# Altium schematic sheet Sheet1.SchDoc: Chassis - Projekt Horizon
size A3; SheetNumber: 1; SheetTotal: 1
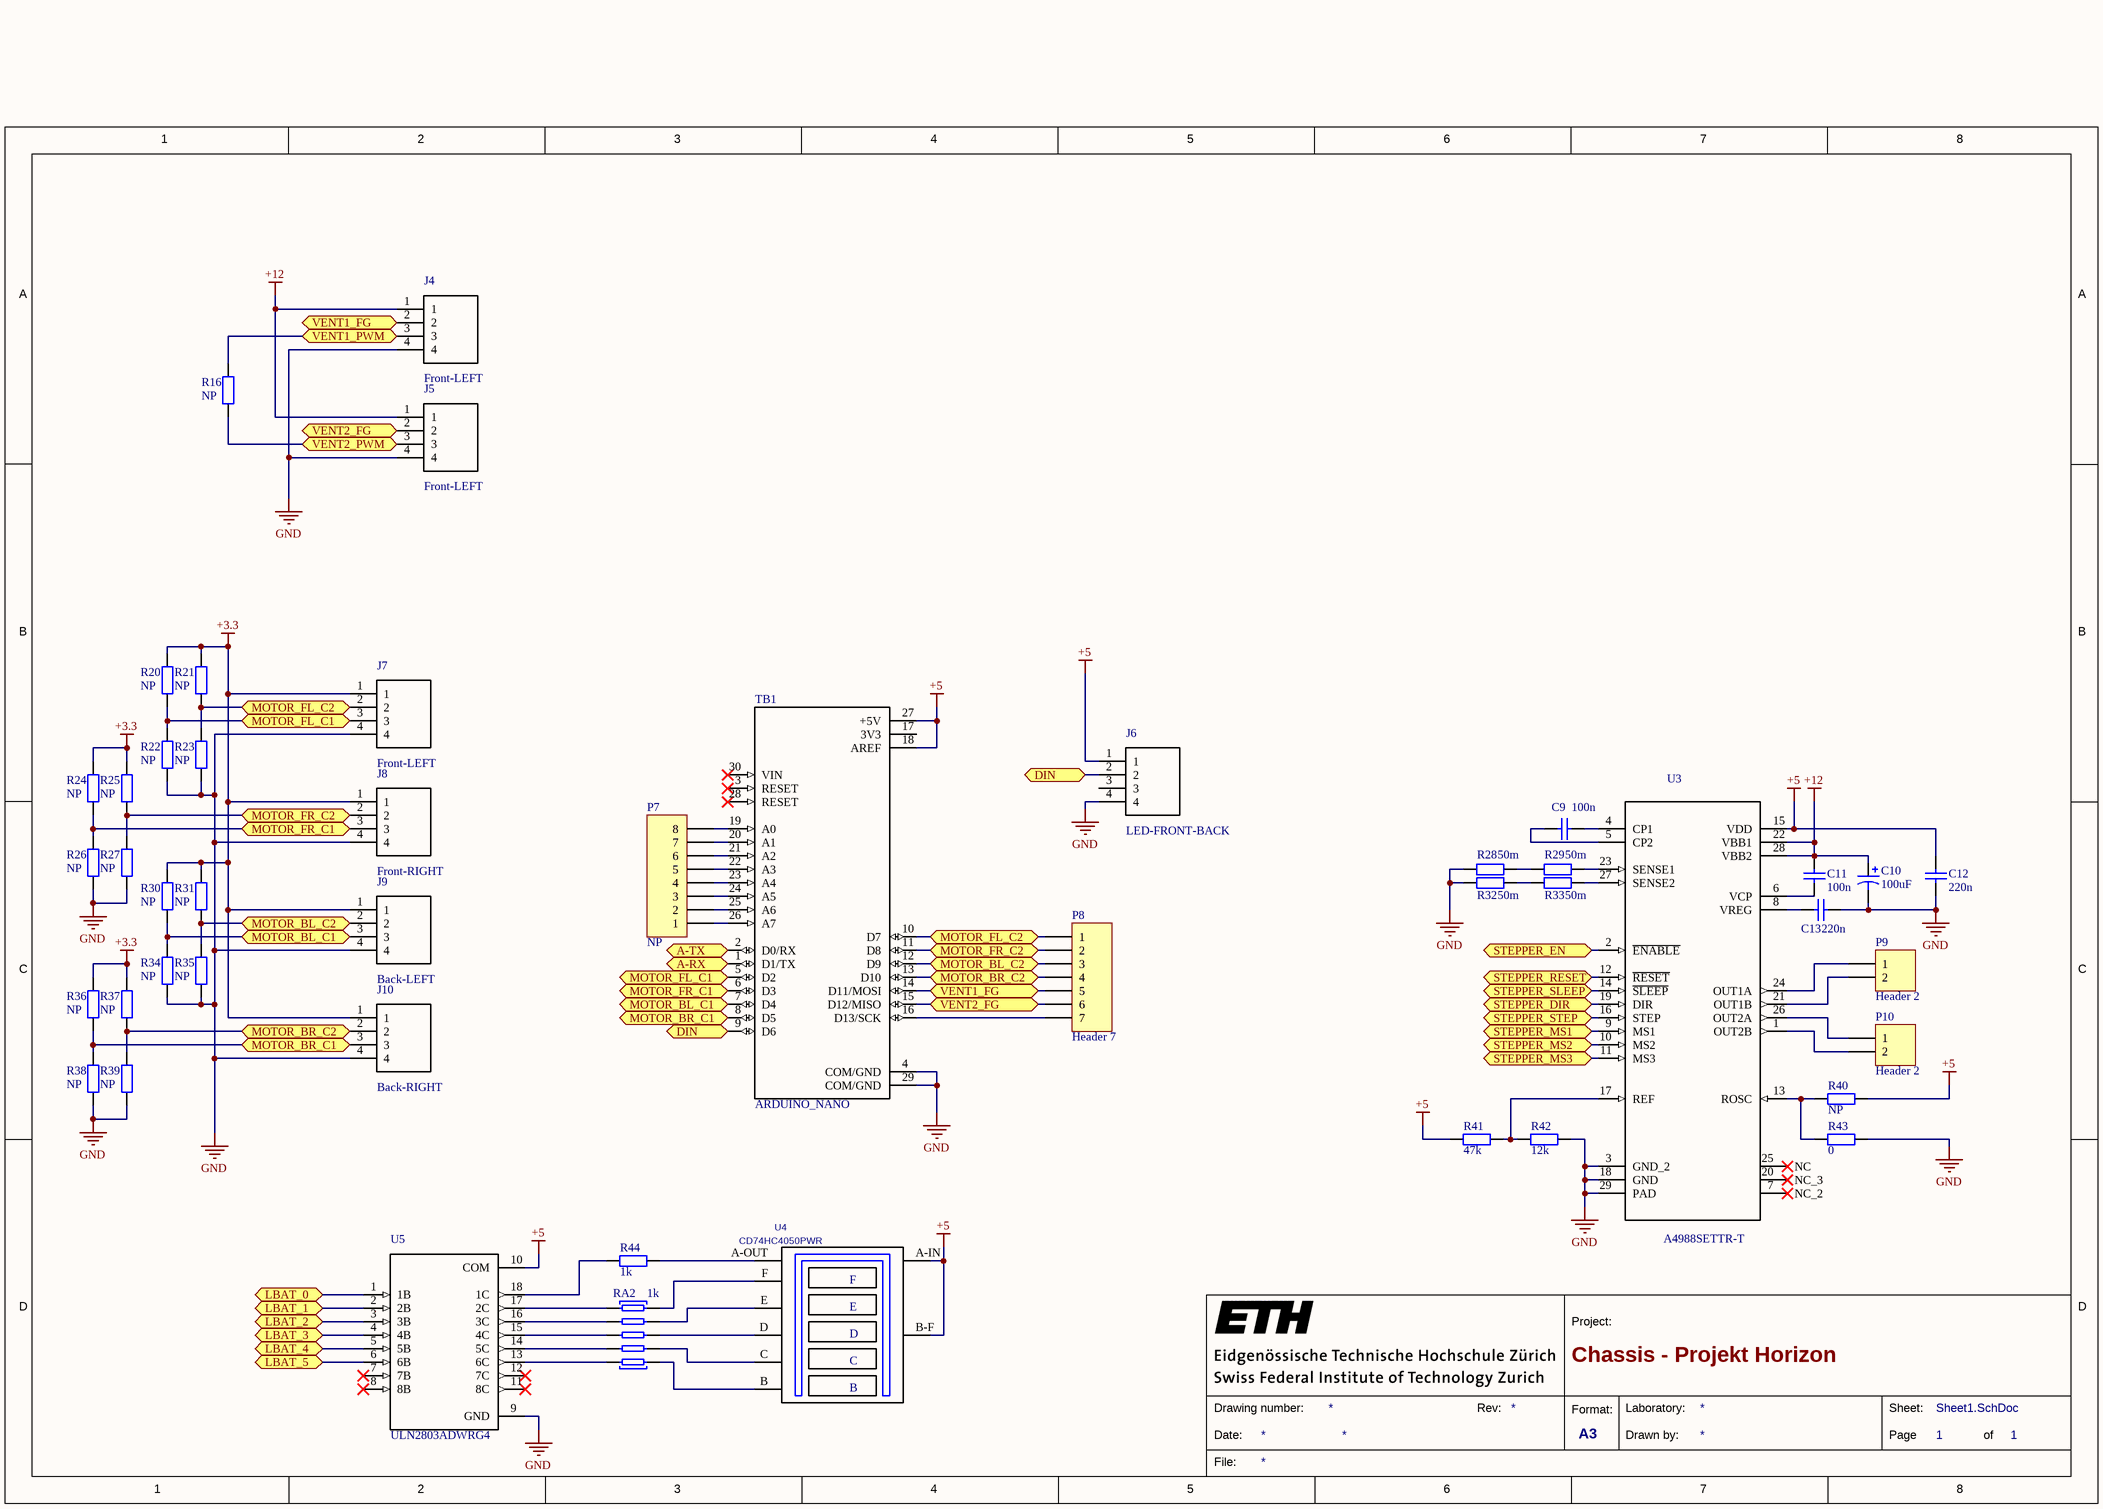
[diagram p0: Sheet1.SchDoc]

## Parts
C9  100n  [CAP_0603i_1608m -N]
C10  100uF  [Cap_F-Type-Package]
C11  100n  [CAP_0603i_1608m -N]
C12  220n  [CAP_0603i_1608m -N]
C13  220n  [CAP_0603i_1608m -N]
J4  Front-LEFT  [*PHOENIX_1751264]
J5  Front-LEFT  [*PHOENIX_1751264]
J6  LED-FRONT-BACK  [*PHOENIX_1751264]
J7  Front-LEFT  [*PHOENIX_1751264]
J8  Front-RIGHT  [*PHOENIX_1751264]
J9  Back-LEFT  [*PHOENIX_1751264]
J10  Back-RIGHT  [*PHOENIX_1751264]
P7  NP  [HDR1X8]
P8  Header 7  [HDR1X7]
P9  Header 2  [3.5MM Phoenix Contact 1984617]
P10  Header 2  [3.5MM Phoenix Contact 1984617]
R16  NP  [RES_0603i_1608m -N]
R20  NP  [RES_0603i_1608m -N]
R21  NP  [RES_0603i_1608m -N]
R22  NP  [RES_0603i_1608m -N]
R23  NP  [RES_0603i_1608m -N]
R24  NP  [RES_0603i_1608m -N]
R25  NP  [RES_0603i_1608m -N]
R26  NP  [RES_0603i_1608m -N]
R27  NP  [RES_0603i_1608m -N]
R28  50m  [RES_1206i_C3216m -N]
R29  50m  [RES_1206i_C3216m -N]
R30  NP  [RES_0603i_1608m -N]
R31  NP  [RES_0603i_1608m -N]
R32  50m  [RES_1206i_C3216m -N]
R33  50m  [RES_1206i_C3216m -N]
R34  NP  [RES_0603i_1608m -N]
R35  NP  [RES_0603i_1608m -N]
R36  NP  [RES_0603i_1608m -N]
R37  NP  [RES_0603i_1608m -N]
R38  NP  [RES_0603i_1608m -N]
R39  NP  [RES_0603i_1608m -N]
R40  NP  [RES_0603i_1608m -N]
R41  47k  [RES_0603i_1608m -N]
R42  12k  [RES_0603i_1608m -N]
R43  0  [RES_0603i_1608m -N]
R44  1k  [RES_0603i_1608m -N]
RA2  1k  [*SIP-10]
TB1  ARDUINO_NANO  [*SHIELD_ARDUINO_NANO]
U3  A4988SETTR-T  [*QFN50P500X500X100-29N]
U4  CD74HC4050PWR  [KYX3118BRG]
U5  ULN2803ADWRG4  [*SOIC127P1030X265-18N]

## Ports
A-RX (bidir), A-TX (bidir), DIN (bidir), LBAT_0 (bidir), LBAT_1 (bidir), LBAT_2 (bidir), LBAT_3 (bidir), LBAT_4 (bidir), LBAT_5 (bidir), MOTOR_BL_C1 (bidir), MOTOR_BL_C2 (bidir), MOTOR_BR_C1 (bidir), MOTOR_BR_C2 (bidir), MOTOR_FL_C1 (bidir), MOTOR_FL_C2 (bidir), MOTOR_FR_C1 (bidir), MOTOR_FR_C2 (bidir), STEPPER_DIR (bidir), STEPPER_EN (bidir), STEPPER_MS1 (bidir), STEPPER_MS2 (bidir), STEPPER_MS3 (bidir), STEPPER_RESET (bidir), STEPPER_SLEEP (bidir), STEPPER_STEP (bidir), VENT1_FG (bidir), VENT1_PWM (bidir), VENT2_FG (bidir), VENT2_PWM (bidir)

## Nets
+3.3: J7.1 J8.1 J9.1 J10.1 R20.2 R21.2 R24.2 R25.2 R30.2 R31.2 R36.2 R37.2
+5: C12.2 J6.1 R40.2 R41.1 TB1.18(AREF) TB1.27(+5V) U3.15(VDD) U4.A-IN U4.B-F U5.10(COM)
+12: C10.1 C11.1 J4.1 J5.1 U3.22(VBB1) U3.28(VBB2)
GND: C10.2 C12.1 C13.2 J4.4 J5.4 J6.4 J7.4 J8.4 J9.4 J10.4 R22.1 R23.1 R26.1 R27.1 R28.1 R32.1 R34.1 R35.1 R38.1 R39.1 R42.2 R43.2 TB1.4(COM/GND) TB1.29(COM/GND) U3.3(GND_2) U3.18(GND) U3.29(PAD) U5.9(GND)
A-RX: TB1.1(D1/TX) ; port A-RX
A-TX: TB1.2(D0/RX) ; port A-TX
DIN: J6.2 TB1.9(D6) ; port DIN
LBAT_0: U5.1(1B) ; port LBAT_0
LBAT_1: U5.2(2B) ; port LBAT_1
LBAT_2: U5.3(3B) ; port LBAT_2
LBAT_3: U5.4(4B) ; port LBAT_3
LBAT_4: U5.5(5B) ; port LBAT_4
LBAT_5: U5.6(6B) ; port LBAT_5
MOTOR_BL_C1: J9.3 R30.1 R34.2 TB1.7(D4) ; port MOTOR_BL_C1
MOTOR_BL_C2: J9.2 P8.3 R31.1 R35.2 TB1.12(D9) ; port MOTOR_BL_C2
MOTOR_BR_C1: J10.3 R36.1 R38.2 TB1.8(D5) ; port MOTOR_BR_C1
MOTOR_BR_C2: J10.2 P8.4 R37.1 R39.2 TB1.13(D10) ; port MOTOR_BR_C2
MOTOR_FL_C1: J7.3 R20.1 R22.2 TB1.5(D2) ; port MOTOR_FL_C1
MOTOR_FL_C2: J7.2 P8.1 R21.1 R23.2 TB1.10(D7) ; port MOTOR_FL_C2
MOTOR_FR_C1: J8.3 R24.1 R26.2 TB1.6(D3) ; port MOTOR_FR_C1
MOTOR_FR_C2: J8.2 P8.2 R25.1 R27.2 TB1.11(D8) ; port MOTOR_FR_C2
STEPPER_DIR: U3.19(DIR) ; port STEPPER_DIR
STEPPER_EN: U3.2(~{ENABLE}) ; port STEPPER_EN
STEPPER_MS1: U3.9(MS1) ; port STEPPER_MS1
STEPPER_MS2: U3.10(MS2) ; port STEPPER_MS2
STEPPER_MS3: U3.11(MS3) ; port STEPPER_MS3
STEPPER_RESET: U3.12(~{RESET}) ; port STEPPER_RESET
STEPPER_SLEEP: U3.14(~{SLEEP}) ; port STEPPER_SLEEP
STEPPER_STEP: U3.16(STEP) ; port STEPPER_STEP
VENT1_FG: J4.2 P8.5 TB1.14(D11/MOSI) ; port VENT1_FG
VENT1_PWM: J4.3 R16.2 ; port VENT1_PWM
VENT2_FG: J5.2 P8.6 TB1.15(D12/MISO) ; port VENT2_FG
VENT2_PWM: J5.3 R16.1 ; port VENT2_PWM
NetC9_1: C9.1 U3.4(CP1)
NetC9_2: C9.2 U3.5(CP2)
NetC11_2: C11.2 U3.6(VCP)
NetC13_1: C13.1 U3.8(VREG)
NetP7_1: P7.1 TB1.26(A7)
NetP7_2: P7.2 TB1.25(A6)
NetP7_3: P7.3 TB1.24(A5)
NetP7_4: P7.4 TB1.23(A4)
NetP7_5: P7.5 TB1.22(A3)
NetP7_6: P7.6 TB1.21(A2)
NetP7_7: P7.7 TB1.20(A1)
NetP7_8: P7.8 TB1.19(A0)
NetP8_7: P8.7 TB1.16(D13/SCK)
NetP9_1: P9.1 U3.24(OUT1A)
NetP9_2: P9.2 U3.21(OUT1B)
NetP10_1: P10.1 U3.26(OUT2A)
NetP10_2: P10.2 U3.1(OUT2B)
NetR28_2: R28.2 R29.1
NetR29_2: R29.2 U3.23(SENSE1)
NetR32_2: R32.2 R33.1
NetR33_2: R33.2 U3.27(SENSE2)
NetR40_1: R40.1 R43.1 U3.13(ROSC)
NetR41_2: R41.2 R42.1 U3.17(REF)
NetR44_1: R44.1 U5.18(1C)
NetR44_2: R44.2 U4.A-OUT
NetRA2_1: RA2.1 U5.17(2C)
NetRA2_2: RA2.2 U4.F
NetRA2_3: RA2.3 U5.16(3C)
NetRA2_4: RA2.4 U4.E
NetRA2_5: RA2.5 U5.15(4C)
NetRA2_6: RA2.6 U4.D
NetRA2_7: RA2.7 U5.14(5C)
NetRA2_8: RA2.8 U4.C
NetRA2_9: RA2.9 U5.13(6C)
NetRA2_10: RA2.10 U4.B

Not connected (* = marked no-connect by the designer): J6 3; TB1 3(RESET)* 17(3V3) 28(RESET)* 30(VIN)*; U3 7(NC_2) 20(NC_3) 25(NC); U5 7(7B)* 8(8B)* 11(8C)* 12(7C)*

## Notes on the sheet
- 1
- 2
- 3
- 4
- 5
- 6
- 7
- 8
- A
- B
- C
- D
- Project:
- Date:
- Drawing number:
- Rev:
- Format:
- A3
- Drawn by:
- Laboratory:
- Page
- Sheet:
- of
- File:

## Library data of the parts
C9 C11-C13 = Cap: capacitor
C10 = Cap pol2: polarised capacitor alternative
J4-J10 = Terminal 4 Pin: Conn; Term Blk; Screw; 4: 3.5 mm; 26-16 AWG; 10 A; 160 V; Solder; 2.5 kV; PA; MP: 1751264; MF: Phoenix Contact; Digi-Key_Purchase_URL: https://www.digikey.com/product-detail/en/phoenix-contact/1751264/277-5744-ND/2511021?utm_source=snapeda&utm_medium=aggregator&utm_campaign=symbol; Package: None; SnapEDA_Link: https://www.snapeda.com/parts/1751264/Phoenix%20Contact/view-part/1231309/?ref=snap; Digi-Key_Part_Number: 277-5744-ND; Value: *
P7 = Header 8: Header, 8-Pin
P8 = Header 7: Header, 7-Pin
P9 P10 = Header 2: Header, 2-Pin
R16 R20-R39 R41-R44 = Res: Resistor
R40 = Res
RA2 = Res Array  5: Isolated Resistor Network
TB1 = ARDUINO_NANO: Dev.kit: Arduino; UART; ICSP, USB B mini, pin strips; MP: ARDUINO NANO; Digi-Key_Purchase_URL: *; Digi-Key_Part_Number: *; MF: Arduino; Package: None; SnapEDA_Link: https://www.snapeda.com/parts/ARDUINO%20NANO/Arduino/view-part/?ref=snap; Value: *
U3 = A4988SETTR-T: DMOS Microstepping Driver with Translator and Overcurrent Protection; MF: Allegro; Digi-Key_Part_Number: 620-1343-1-ND; Package: QFN-28 Allegro MicroSystems LLC; MP: A4988SETTR-T; Digi-Key_Purchase_URL: https://www.digikey.ch/product-detail/en/allegro-microsystems/A4988SETTR-T/620-1343-1-ND/2238004?utm_source=snapeda&utm_medium=aggregator&utm_campaign=symbol; SnapEDA_Link: https://www.snapeda.com/parts/A4988SETTR-T/Allegro%20Industries/view-part/46276/?ref=snap; Value: *
U4 = KYX3118BRG: Manufacturer: Texas Instruments; C: Copyright (C) 2015 Accelerated Designs. All rights reserved; Built_By: EMA_UL_Team; Value: CD74HC4050PWR; Vendor: Vendor; Manufacturer_Part_Number: CD74HC4050PWR
U5 = ULN2803ADWRG4: Trans Darlington NPN 50V 0.5A 18-Pin SOIC T/R; MF: Texas Instruments; Digi-Key_Part_Number: 296-35964-1-ND; SnapEDA_Link: https://www.snapeda.com/parts/ULN2803ADWRG4/Texas%20Instruments/view-part/1177700/?ref=snap; Package: SOIC-18 Texas Instruments; MP: ULN2803ADWRG4; Digi-Key_Purchase_URL: https://www.digikey.com/product-detail/en/texas-instruments/ULN2803ADWRG4/296-35964-1-ND/4134939?utm_source=snapeda&utm_medium=aggregator&utm_campaign=symbol; Value: *